# Altium schematic sheet main.SchDoc: CS - Main
size Letter; CheckedBy: J. Brinton; CompanyName: Signal Laboratories, Inc.; DrawnBy: J. Brinton; Engineer: J. Brinton; Address1: 3479 Edison Way; Address2: Menlo Park CA 94025; Address3: +1 (877) 778-8435; Address4: siglabs.com; Revision: 3; SheetNumber: 2; SheetTotal: 47
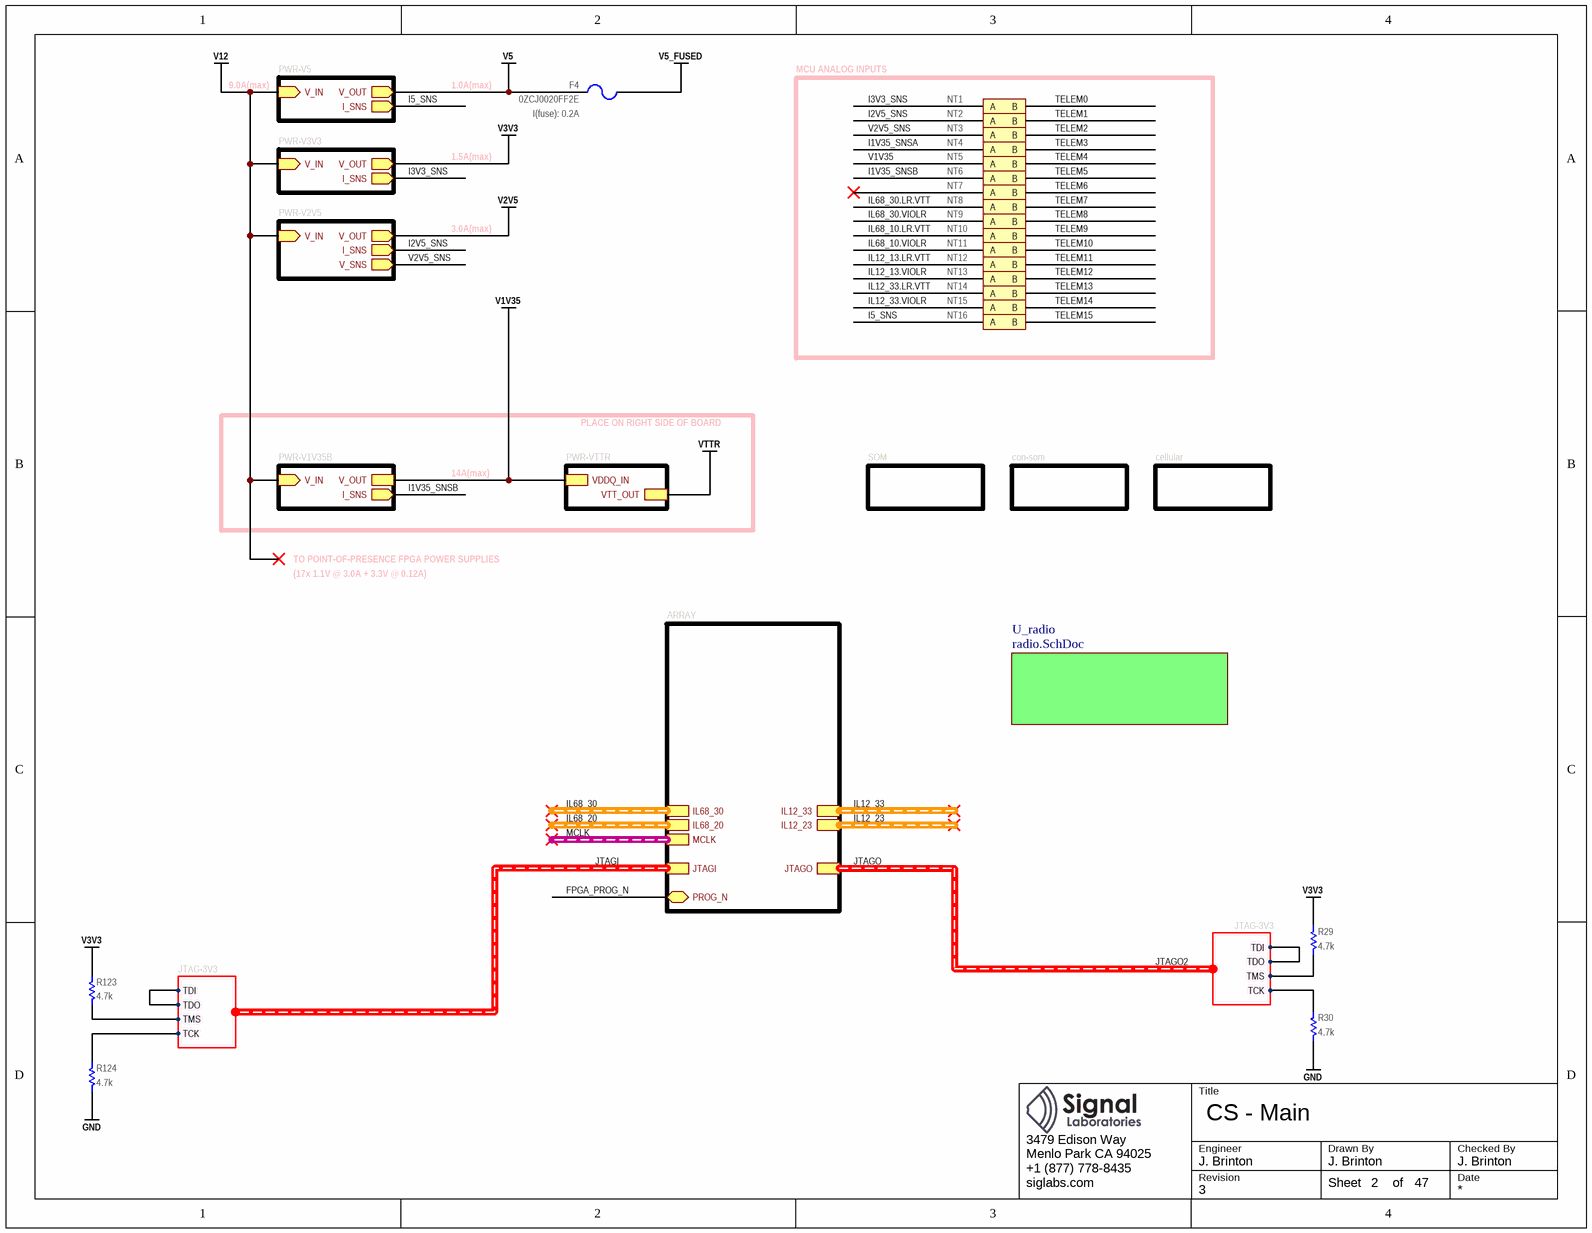
[diagram p0: main.SchDoc]

## Parts
F4  0ZCJ0020FF2E  I(fuse): 0.2A  [1206]
NT1  NET_TIE  [NET_TIE]  (value not drawn)  (net tie, no BOM)
NT2  NET_TIE  [NET_TIE]  (value not drawn)  (net tie, no BOM)
NT3  NET_TIE  [NET_TIE]  (value not drawn)  (net tie, no BOM)
NT4  NET_TIE  [NET_TIE]  (value not drawn)  (net tie, no BOM)
NT5  NET_TIE  [NET_TIE]  (value not drawn)  (net tie, no BOM)
NT6  NET_TIE  [NET_TIE]  (value not drawn)  (net tie, no BOM)
NT7  NET_TIE  [NET_TIE]  (value not drawn)  (net tie, no BOM)
NT8  NET_TIE  [NET_TIE]  (value not drawn)  (net tie, no BOM)
NT9  NET_TIE  [NET_TIE]  (value not drawn)  (net tie, no BOM)
NT10  NET_TIE  [NET_TIE]  (value not drawn)  (net tie, no BOM)
NT11  NET_TIE  [NET_TIE]  (value not drawn)  (net tie, no BOM)
NT12  NET_TIE  [NET_TIE]  (value not drawn)  (net tie, no BOM)
NT13  NET_TIE  [NET_TIE]  (value not drawn)  (net tie, no BOM)
NT14  NET_TIE  [NET_TIE]  (value not drawn)  (net tie, no BOM)
NT15  NET_TIE  [NET_TIE]  (value not drawn)  (net tie, no BOM)
NT16  NET_TIE  [NET_TIE]  (value not drawn)  (net tie, no BOM)
R29  value 4.7k  [RESC1005X40N]  (hidden comment: ERJ-2RKF4701X)
R30  value 4.7k  [RESC1005X40N]  (hidden comment: ERJ-2RKF4701X)
R123  value 4.7k  [RESC1005X40N]  (hidden comment: ERJ-2RKF4701X)
R124  value 4.7k  [RESC1005X40N]  (hidden comment: ERJ-2RKF4701X)

## Blocks framed on the sheet
MCU ANALOG INPUTS: NT1-NT16

## Sub-sheets
ARRAY = array.SchDoc: IL68_20 (harness IL), IL68_30 (harness IL), IL12_33 (harness IL), IL12_23 (harness IL), MCLK (harness LVPECL33), JTAGI (harness JTAG-3V3), JTAGO (harness JTAG-3V3), PROG_N (bidir)
cellular = cellular.SchDoc: no entries
con-som = con-som.SchDoc: no entries
PWR-V1V35B = power-v1v35.SchDoc: I_SNS (out), V_OUT, V_IN (in)
PWR-V2V5 = power-v2v5.SchDoc: I_SNS (out), V_SNS (out), V_IN (in), V_OUT (out)
PWR-V3V3 = power-v3v3.SchDoc: I_SNS (out), V_IN (in), V_OUT (out)
PWR-V5 = power-v5.SchDoc: V_IN (in), V_OUT (out), I_SNS (out)
PWR-VTTR = power-vtt.SchDoc: VTT_OUT, VDDQ_IN
SOM = som.SchDoc: no entries
U_radio = radio.SchDoc: no entries

## Harnesses
JTAG-3V3: TMS, TCK, TDI, TDO

## Nets
GND: R30.1 R124.1
V1V35: NT5.A ; sheet PWR-V1V35B/V_OUT, sheet PWR-VTTR/VDDQ_IN
V2V5: sheet PWR-V2V5/V_OUT
V3V3: R29.2 R123.2 ; sheet PWR-V3V3/V_OUT
V5: F4.1 ; sheet PWR-V5/V_OUT
V5_FUSED: F4.2
V12: sheet PWR-V3V3/V_IN, sheet PWR-V1V35B/V_IN, sheet PWR-V5/V_IN, sheet PWR-V2V5/V_IN
VTTR: sheet PWR-VTTR/VTT_OUT
FPGA_PROG_N: sheet ARRAY/PROG_N
I1V35_SNSA: NT4.A
I1V35_SNSB: NT6.A ; sheet PWR-V1V35B/I_SNS
I2V5_SNS: NT2.A ; sheet PWR-V2V5/I_SNS
I3V3_SNS: NT1.A ; sheet PWR-V3V3/I_SNS
I5_SNS: NT16.A ; sheet PWR-V5/I_SNS
IL12_13.LR.VTT: NT12.A
IL12_13.VIOLR: NT13.A
IL12_33.LR.VTT: NT14.A
IL12_33.VIOLR: NT15.A
IL68_10.LR.VTT: NT10.A
IL68_10.VIOLR: NT11.A
IL68_30.LR.VTT: NT8.A
IL68_30.VIOLR: NT9.A
JTAGI.TCK: R124.2 ; sheet ARRAY/JTAGI.TCK
JTAGI.TDI: sheet ARRAY/JTAGI.TDI, sheet ARRAY/JTAGI.TDO
JTAGI.TMS: R123.1 ; sheet ARRAY/JTAGI.TMS
JTAGO.TCK: R30.2 ; sheet ARRAY/JTAGO.TCK
JTAGO.TDI: sheet ARRAY/JTAGO.TDI, sheet ARRAY/JTAGO.TDO
JTAGO.TMS: R29.1 ; sheet ARRAY/JTAGO.TMS
TELEM0: NT1.B
TELEM1: NT2.B
TELEM2: NT3.B
TELEM3: NT4.B
TELEM4: NT5.B
TELEM5: NT6.B
TELEM6: NT7.B
TELEM7: NT8.B
TELEM8: NT9.B
TELEM9: NT10.B
TELEM10: NT11.B
TELEM11: NT12.B
TELEM12: NT13.B
TELEM13: NT14.B
TELEM14: NT15.B
TELEM15: NT16.B
V2V5_SNS: NT3.A ; sheet PWR-V2V5/V_SNS

Not connected (* = marked no-connect by the designer): NT7 A*

## Buses and harness runs
harness IL12_23 = sheet ARRAY/IL12_23
harness IL12_33 = sheet ARRAY/IL12_33
harness IL68_20 = sheet ARRAY/IL68_20
harness IL68_30 = sheet ARRAY/IL68_30
harness JTAGI = sheet ARRAY/JTAGI
harness JTAGO = JTAGO2 = sheet ARRAY/JTAGO
harness MCLK = sheet ARRAY/MCLK

## Notes on the sheet
- 9.0A(max)
- 1.0A(max)
- 1.5A(max)
- 3.0A(max)
- PLACE ON RIGHT SIDE OF BOARD
- 14A(max)
- TO POINT-OF-PRESENCE FPGA POWER SUPPLIES
- (17x 1.1V @ 3.0A + 3.3V @ 0.12A)
- Title
- Engineer
- Revision
- Drawn By
- Checked By
- Date
- Sheet
- of

## Library data of the parts
F4 = 0ZCJ0020FF2E: PTC Resettable Fuse, 0.2A, 30V, SMD 1206; Manufacturer: Bell Fuse; Manufacturer P/N: 0ZCJ0020FF2E
R29 R30 R123 R124 = RES: Thick Film Resistor 4.7k ±1% 0.1W 75V 0402; Manufacturer: Panasonic; Tcr: ±100; Tr: -55:155; Voltage: 75; Power: 0.1; Tolerance: ±1%; Manufacturer P/N: ERJ-2RKF4701X; Alternatives: *; Footprint: *; Package: 0402